# EAGLE design gear (EAGLE 8.3.1)
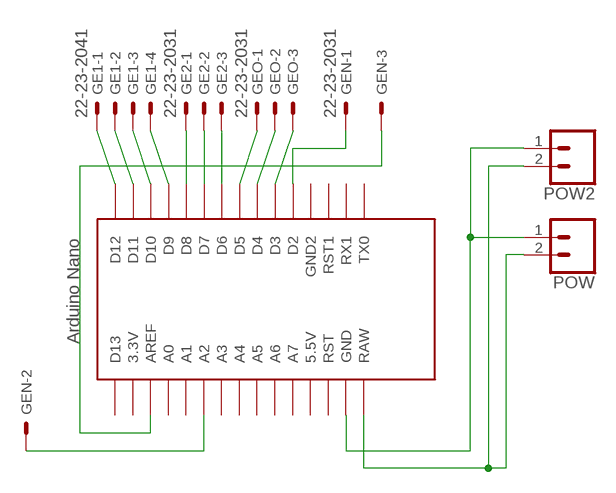
[diagram p0: schematic, sheet 1]

## Parts
GE1  22-23-2041  [22-23-2041]
GE2  22-23-2031  [22-23-2031]
GEN  22-23-2031  [22-23-2031]
GEO  22-23-2031  [22-23-2031]
POW  CONN_025MM  [SCREWTERMINAL-5MM-2]
POW2  CONN_025MM  [SCREWTERMINAL-5MM-2]
U$1  NANO  [NANO]

## Nets
N$1: GE1.1 U$1.D12
N$2: GE1.2 U$1.D11
N$3: GE1.3 U$1.D10
N$4: GE1.4 U$1.D9
N$5: GE2.1 U$1.D8
N$6: GE2.2 U$1.D7
N$7: GE2.3 U$1.D6
N$8: GEO.1 U$1.D5
N$9: GEO.2 U$1.D4
N$10: GEO.3 U$1.D3
N$11: POW2.1 POW.1 U$1.GND
N$12: POW2.2 POW.2 U$1.RAW
N$13: GEN.1 U$1.D2
N$14: GEN.2 U$1.A2
N$15: GEN.3 U$1.AREF
Unconnected: U$1.3.3V U$1.5V(5.5V) U$1.A0 U$1.A1 U$1.A3 U$1.A4 U$1.A5 U$1.A6 U$1.A7 U$1.D13 U$1.GND1(GND2) U$1.ICSP1 U$1.ICSP2 U$1.ICSP3 U$1.ICSP4 U$1.ICSP5 U$1.ICSP6 U$1.RST U$1.RST1 U$1.RX1 U$1.TX0

## Library data of the parts
GE1 = con-molex:22-23-2041: .100" (2.54mm) Center Header - 4 Pin; MF: MOLEX; MPN: 22-23-2041; OC_FARNELL: 1462920; OC_NEWARK: 38C0355
GE2 GEN GEO = con-molex:22-23-2031: .100" (2.54mm) Center Header - 3 Pin; MF: MOLEX; MPN: 22-23-2031; OC_FARNELL: 1462950; OC_NEWARK: 30C0862
POW POW2 = SparkFun-Retired:CONN_02: Multi connection point. Often used as Generic Header-pin footprint for 0.1 inch spaced/style header connections On any of the 0.1 inch spaced packages, you can populate with these: Break Away Headers - Straight <https://www.sparkfun.com/products/116> (PRT-00116) Break Away Male Headers - Right Angle <https://www.sparkfun.com/products/553> (PRT-00553) Female Headers <https://www.sparkfun.com/products/115> (PRT-00115) Break Away Headers - Machine Pin <https://www.sparkfun.com/products/117> (PRT-00117) Break Away Female Headers - Swiss Machine Pin <https://www.sparkfun.com/products/743> (PRT-00743) For SCREWTERMINALS and SPRING TERMINALS visit here: Screw Terimnals on SparkFun.com <https://www.sparkfun.com/search/results?term=Screw+Terminals> (5mm/3.5mm/2.54mm spacing) This device is also useful as a general connection point to wire up your design to another part of your project. Our various solder wires solder well into these plated through hole pads. Hook-Up Wire - Assortment (Stranded, 22 AWG) <https://www.sparkfun.com/products/11375> (PRT-11375) Hook-Up Wire - Assortment (Solid Core, 22 AWG) <https://www.sparkfun.com/products/11367> (PRT-11367) View the entire wire category on our website here <https://www.sparkfun.com/categories/141> Special notes: Molex polarized connector foot print use with: PRT-08233 with associated crimp pins and housings. 2.54_SCREWTERM for use with PRT-10571. 3.5mm Screw Terminal footprints for PRT-08084 5mm Screw Terminal footprints for use with PRT-08432; SF_SKU: PRT-08432
U$1 = Arduino-clone:NANO: Arduino Nano

## Net classes
0 default: width 0.635 mm, drill 0.305 mm, clearance 0.508 mm

## Board
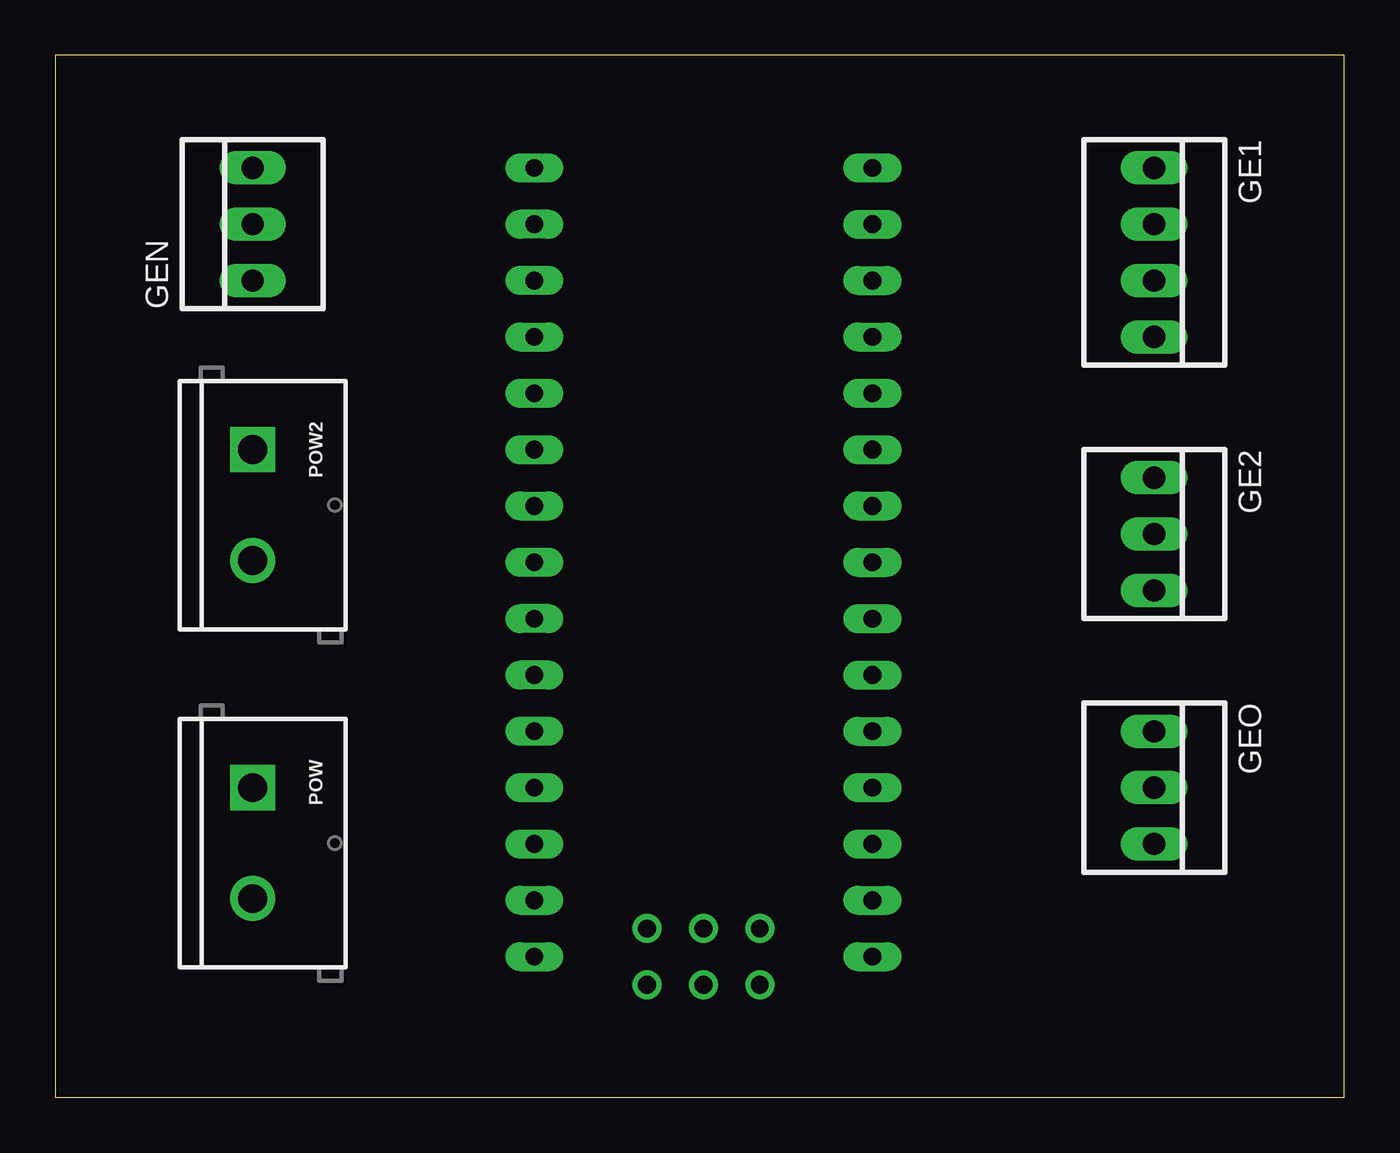
[diagram p1: board, top side]
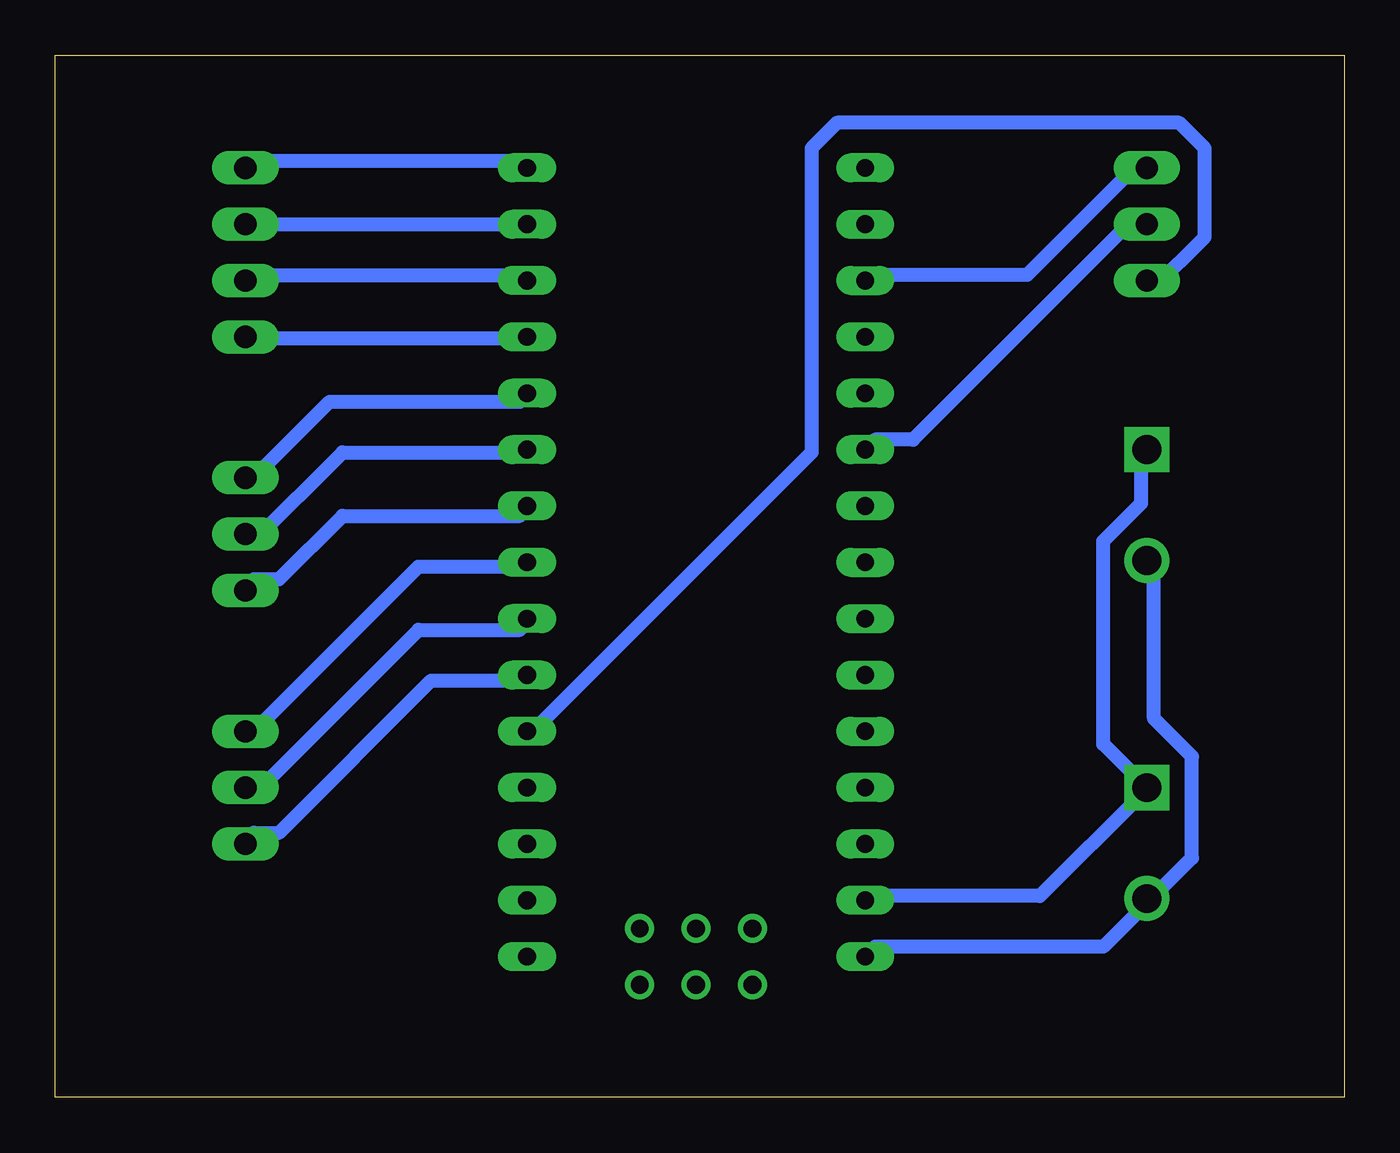
[diagram p2: board, bottom side, seen from below]

Size 58.09 x 46.98 mm. Coordinates in mm from the lower left corner, seen from the top.
Outline: 0,0 58.09,0 58.09,46.98 0,46.98 0,0
Copper layers (1*16): Top 0.035mm / dielectric 1.5mm / Bottom 0.035mm
Design rules "default": minimum track width 6mil, minimum drill 0.35mm, track to track 6mil, track to pad 6mil, pad to pad 6mil, via to via 6mil, smd to smd 6mil, copper to edge 40mil, drill to drill 6mil, minimum pad ring 10mil, minimum via ring 8mil, stop-mask expansion 4mil, vias tented up to drill 0mil, thermal gap 10mil

### Footprints (pad centres in the part's own frame; a part is rotated, then mirrored left to right if it is on the bottom)
22-23-2041 = drill 1 long: 1 -3.81,0; 2 -1.27,0; 3 1.27,0; 4 3.81,0
22-23-2031 = drill 1 long: 1 -2.54,0; 2 0,0; 3 2.54,0
SCREWTERMINAL-5MM-2 = drill 1.3 pad 2.032 square: 1 0,0 | drill 1.3 pad 2.032: 2 5,0
NANO = drill 0.8 long: 3.3V -10.16,24.13; 5V -10.16,-1.27; A0 -10.16,19.05; A1 -10.16,16.51; A2 -10.16,13.97; A3 -10.16,11.43; A4 -10.16,8.89; A5 -10.16,6.35; A6 -10.16,3.81; A7 -10.16,1.27; AREF -10.16,21.59; D2 5.08,1.27; D3 5.08,3.81; D4 5.08,6.35; D5 5.08,8.89; D6 5.08,11.43; D7 5.08,13.97; D8 5.08,16.51; D9 5.08,19.05; D10 5.08,21.59; D11 5.08,24.13; D12 5.08,26.67; D13 -10.16,26.67; GND -10.16,-6.35; GND1 5.08,-1.27; RAW -10.16,-8.89; RST -10.16,-3.81; RST1 5.08,-3.81; RX1 5.08,-6.35; TX0 5.08,-8.89 | drill 0.8: ICSP1 -5.08,-10.16; ICSP2 -5.08,-7.62; ICSP3 -2.54,-10.16; ICSP4 -2.54,-7.62; ICSP5 0,-10.16; ICSP6 0,-7.62

### Placement (x,y rotation side)
GE1  49.53,38.1 270 top
GE2  49.53,25.4 270 top
GEN  8.89,39.37 90 top
GEO  49.53,13.97 270 top
POW  8.89,13.97 270 top
POW2  8.89,29.21 270 top
U$1  31.75,15.24 0 top

### Tracks (layer width: path | path; a pad name or v marks a point on that pad's centre or on a via)
N$1
  Bottom 0.635: U$1.D12 37.15,42.23 49.15,42.23 GE1.1
N$2
  Bottom 0.635: GE1.2 U$1.D11
N$3
  Bottom 0.635: U$1.D10 37.15,37.08 49.15,37.08 GE1.3
N$4
  Bottom 0.635: U$1.D9 37.15,34.23 49.15,34.23 GE1.4
N$5
  Bottom 0.635: U$1.D8 37.15,31.37 45.72,31.37 49.15,27.94 GE2.1
N$6
  Bottom 0.635: U$1.D7 37.15,29.08 45.15,29.08 49.15,25.08 GE2.2
N$7
  Bottom 0.635: U$1.D6 37.15,26.23 45.15,26.23 48.01,23.37 49.15,23.37 GE2.3
N$8
  Bottom 0.635: U$1.D5 37.15,23.94 41.72,23.94 49.15,16.51 GEO.1
N$9
  Bottom 0.635: U$1.D4 37.15,21.08 41.72,21.08 49.15,13.65 GEO.2
N$10
  Bottom 0.635: U$1.D3 37.15,18.8 41.15,18.8 48.01,11.94 49.15,11.94 GEO.3
N$11
  Bottom 0.635: U$1.GND 21.14,9.08 13.72,9.08 9.14,13.65 POW.1 10.86,15.94 10.86,25.08 9.14,26.8 9.14,29.08 POW2.1
N$12
  Bottom 0.635: U$1.RAW 21.14,6.79 10.86,6.79 9.14,8.51 POW.2 8.57,9.08 6.86,10.79 6.86,15.37 8.57,17.08 8.57,23.94 POW2.2
N$13
  Bottom 0.635: U$1.D2 36.58,16.51 24,29.08 24,42.8 22.86,43.94 7.43,43.94 6.29,42.8 6.29,38.8 8.57,36.51 GEN.1
N$14
  Bottom 0.635: GEN.2 9.72,39.37 19.43,29.66 21.14,29.66 U$1.A2
N$15
  Bottom 0.635: U$1.AREF 21.14,37.08 14.29,37.08 9.14,42.23 GEN.3